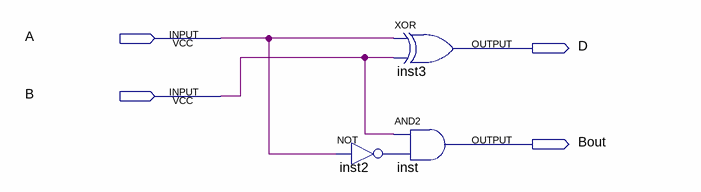
[diagram p0: schematic sheet]
// Quartus schematic halfSubtractor.bdf as structural Verilog: 3 symbols, 4 pins
module halfSubtractor (
  input  A,
  input  B,
  output D,
  output Bout
);

  wire inst2_out;

  xor inst3 (D, A, B);
  and inst (Bout, B, inst2_out);
  not inst2 (inst2_out, A);
endmodule
